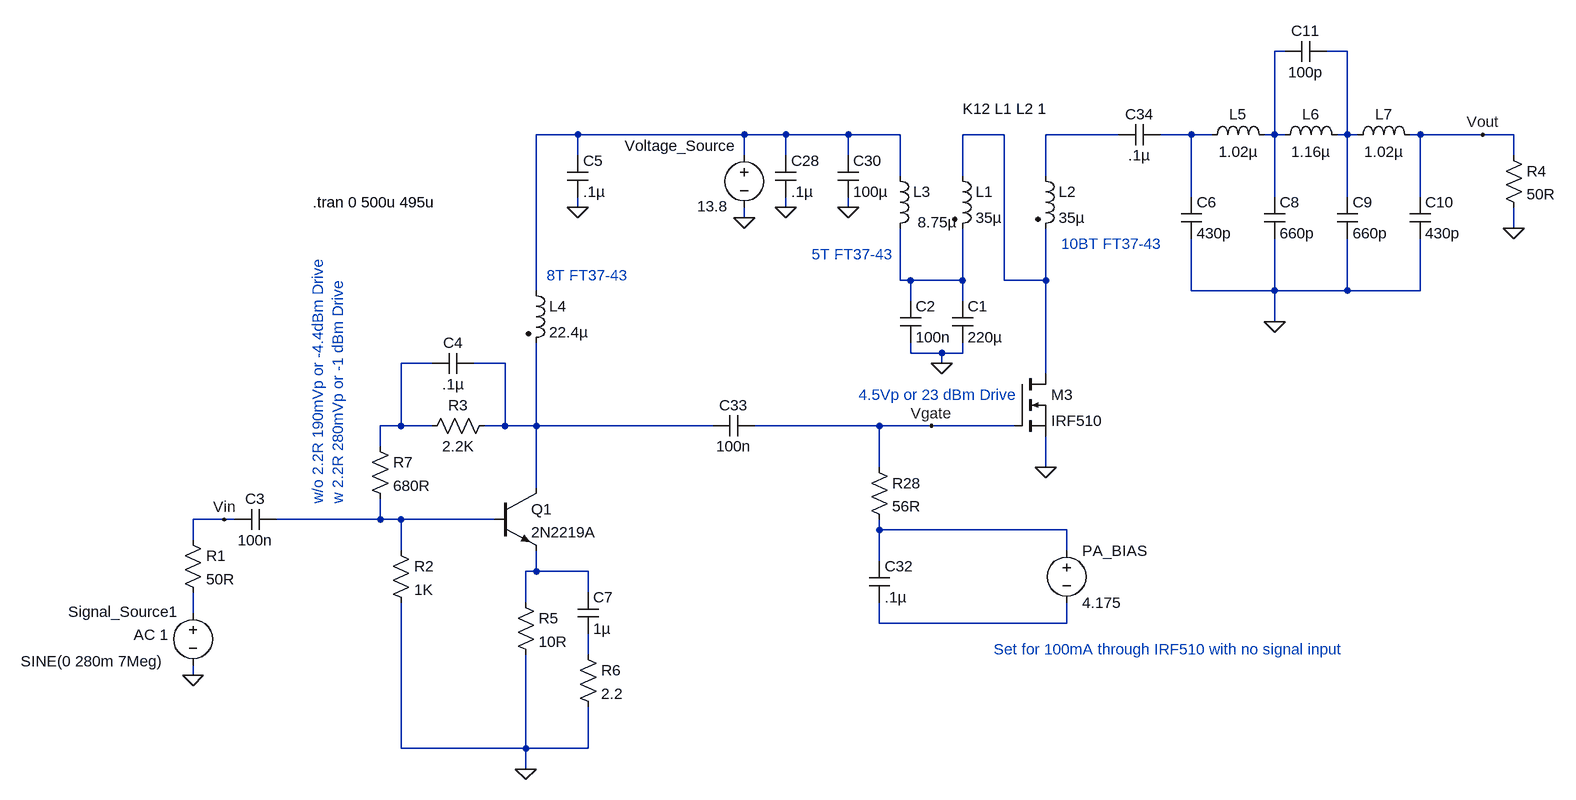
[diagram p0: schematic Power Amp Driver+IRF510 Stage.asc]
Power Amp Driver+IRF510 Stage.asc, the LTspice schematic file:
Version 4
SHEET 1 2716 3076
WIRE 1280 1264 1264 1264
WIRE 1376 1264 1344 1264
WIRE 192 1392 128 1392
WIRE 448 1392 192 1392
WIRE 512 1392 448 1392
WIRE 608 1392 512 1392
WIRE 688 1392 608 1392
WIRE 848 1392 784 1392
WIRE 1024 1392 912 1392
WIRE 1136 1392 1088 1392
WIRE 1168 1392 1136 1392
WIRE 1264 1392 1264 1264
WIRE 1264 1392 1248 1392
WIRE 1280 1392 1264 1392
WIRE 1376 1392 1376 1264
WIRE 1376 1392 1360 1392
WIRE 1392 1392 1376 1392
WIRE 1488 1392 1472 1392
WIRE 1584 1392 1488 1392
WIRE 1632 1392 1584 1392
WIRE 192 1424 192 1392
WIRE 448 1424 448 1392
WIRE 512 1424 512 1392
WIRE 608 1424 608 1392
WIRE 1632 1424 1632 1392
WIRE 688 1456 688 1392
WIRE 784 1456 784 1392
WIRE 912 1456 912 1392
WIRE 1136 1488 1136 1392
WIRE 1264 1488 1264 1392
WIRE 1376 1488 1376 1392
WIRE 1488 1488 1488 1392
WIRE 192 1504 192 1488
WIRE 512 1504 512 1488
WIRE 608 1504 608 1488
WIRE 448 1520 448 1504
WIRE 1632 1536 1632 1504
WIRE 688 1616 688 1536
WIRE 704 1616 688 1616
WIRE 784 1616 784 1536
WIRE 784 1616 704 1616
WIRE 848 1616 848 1392
WIRE 912 1616 912 1536
WIRE 912 1616 848 1616
WIRE 128 1632 128 1392
WIRE 1136 1632 1136 1552
WIRE 1264 1632 1264 1552
WIRE 1264 1632 1136 1632
WIRE 1376 1632 1376 1552
WIRE 1376 1632 1264 1632
WIRE 1488 1632 1488 1552
WIRE 1488 1632 1376 1632
WIRE 704 1648 704 1616
WIRE 784 1648 784 1616
WIRE 1264 1680 1264 1632
WIRE 704 1728 704 1712
WIRE 752 1728 704 1728
WIRE 784 1728 784 1712
WIRE 784 1728 752 1728
WIRE -32 1744 -80 1744
WIRE 80 1744 32 1744
WIRE 752 1744 752 1728
WIRE 912 1760 912 1616
WIRE -80 1840 -80 1744
WIRE -80 1840 -112 1840
WIRE -32 1840 -80 1840
WIRE 80 1840 80 1744
WIRE 80 1840 48 1840
WIRE 128 1840 128 1712
WIRE 128 1840 80 1840
WIRE 400 1840 128 1840
WIRE 656 1840 464 1840
WIRE 736 1840 656 1840
WIRE 864 1840 736 1840
WIRE -112 1872 -112 1840
WIRE 656 1904 656 1840
WIRE 912 1904 912 1856
WIRE 128 1936 128 1840
WIRE -352 1984 -400 1984
WIRE -336 1984 -352 1984
WIRE -112 1984 -112 1952
WIRE -112 1984 -272 1984
WIRE -80 1984 -112 1984
WIRE 64 1984 -80 1984
WIRE 656 2000 656 1984
WIRE 944 2000 656 2000
WIRE -400 2016 -400 1984
WIRE -80 2032 -80 1984
WIRE 944 2032 944 2000
WIRE 656 2048 656 2000
WIRE 128 2064 128 2032
WIRE 128 2064 112 2064
WIRE 208 2064 128 2064
WIRE 208 2096 208 2064
WIRE 112 2112 112 2064
WIRE -400 2128 -400 2096
WIRE 656 2144 656 2112
WIRE 944 2144 944 2112
WIRE 944 2144 656 2144
WIRE 208 2192 208 2160
WIRE -400 2224 -400 2208
WIRE -80 2336 -80 2112
WIRE 112 2336 112 2192
WIRE 112 2336 -80 2336
WIRE 208 2336 208 2272
WIRE 208 2336 112 2336
WIRE 112 2368 112 2336
FLAG 512 1504 0
FLAG 608 1504 0
FLAG 912 1904 0
FLAG 736 1840 Vgate
FLAG 448 1520 0
FLAG 752 1744 0
FLAG -400 2224 0
FLAG 192 1504 0
FLAG -352 1984 Vin
FLAG 112 2368 0
FLAG 1632 1536 0
FLAG 1584 1392 Vout
FLAG 1264 1680 0
SYMBOL nmos 864 1760 R0
SYMATTR InstName M3
SYMATTR Value IRF510
SYMBOL voltage 448 1408 R0
WINDOW 123 0 0 Left 2
WINDOW 39 0 0 Left 2
WINDOW 0 -184 1 Left 2
WINDOW 3 -72 94 Left 2
SYMATTR InstName Voltage_Source
SYMATTR Value 13.8
SYMBOL cap 496 1424 R0
SYMATTR InstName C28
SYMATTR Value .1µ
SYMBOL ind2 768 1440 R0
SYMATTR InstName L1
SYMATTR Value 35µ
SYMATTR Type ind
SYMBOL ind2 896 1440 R0
SYMATTR InstName L2
SYMATTR Value 35µ
SYMATTR Type ind
SYMBOL ind 672 1440 R0
WINDOW 3 43 87 Left 2
SYMATTR Value 8.75µ
SYMATTR InstName L3
SYMBOL cap 592 1424 R0
SYMATTR InstName C30
SYMATTR Value 100µ
SYMBOL res 640 1888 R0
SYMATTR InstName R28
SYMATTR Value 56R
SYMBOL cap 640 2048 R0
SYMATTR InstName C32
SYMATTR Value .1µ
SYMBOL voltage 944 2016 R0
WINDOW 123 0 0 Left 2
WINDOW 39 0 0 Left 2
SYMATTR InstName PA_BIAS
SYMATTR Value 4.175
SYMBOL cap 464 1824 R90
WINDOW 0 0 32 VBottom 2
WINDOW 3 32 32 VTop 2
SYMATTR InstName C33
SYMATTR Value 100n
SYMBOL cap 1088 1376 R90
WINDOW 0 0 32 VBottom 2
WINDOW 3 32 32 VTop 2
SYMATTR InstName C34
SYMATTR Value .1µ
SYMBOL cap 768 1648 R0
SYMATTR InstName C1
SYMATTR Value 220µ
SYMBOL cap 688 1648 R0
SYMATTR InstName C2
SYMATTR Value 100n
SYMBOL voltage -400 2112 R0
WINDOW 3 -265 90 Left 2
WINDOW 123 -91 49 Left 2
WINDOW 0 -192 14 Left 2
WINDOW 39 0 0 Left 2
SYMATTR Value SINE(0 280m 7Meg)
SYMATTR Value2 AC 1
SYMATTR InstName Signal_Source1
SYMBOL res -416 2000 R0
SYMATTR InstName R1
SYMATTR Value 50R
SYMBOL npn 64 1936 R0
SYMATTR InstName Q1
SYMATTR Value 2N2219A
SYMBOL cap -272 1968 R90
WINDOW 0 0 32 VBottom 2
WINDOW 3 32 32 VTop 2
SYMATTR InstName C3
SYMATTR Value 100n
SYMBOL res -96 2016 R0
SYMATTR InstName R2
SYMATTR Value 1K
SYMBOL res 64 1824 R90
WINDOW 0 0 56 VBottom 2
WINDOW 3 32 56 VTop 2
SYMATTR InstName R3
SYMATTR Value 2.2K
SYMBOL cap 32 1728 R90
WINDOW 0 0 32 VBottom 2
WINDOW 3 32 32 VTop 2
SYMATTR InstName C4
SYMATTR Value .1µ
SYMBOL ind2 112 1616 R0
SYMATTR InstName L4
SYMATTR Value 22.4µ
SYMATTR Type ind
SYMBOL res 96 2096 R0
SYMATTR InstName R5
SYMATTR Value 10R
SYMBOL cap 176 1424 R0
SYMATTR InstName C5
SYMATTR Value .1µ
SYMBOL res -128 1856 R0
SYMATTR InstName R7
SYMATTR Value 680R
SYMBOL cap 192 2096 R0
SYMATTR InstName C7
SYMATTR Value 1µ
SYMBOL res 1616 1408 R0
SYMATTR InstName R4
SYMATTR Value 50R
SYMBOL ind 1152 1408 R270
WINDOW 0 32 56 VTop 2
WINDOW 3 5 56 VBottom 2
SYMATTR InstName L5
SYMATTR Value 1.02µ
SYMBOL ind 1264 1408 R270
WINDOW 0 32 56 VTop 2
WINDOW 3 5 56 VBottom 2
SYMATTR InstName L6
SYMATTR Value 1.16µ
SYMBOL ind 1376 1408 R270
WINDOW 0 32 56 VTop 2
WINDOW 3 5 56 VBottom 2
SYMATTR InstName L7
SYMATTR Value 1.02µ
SYMBOL cap 1120 1488 R0
SYMATTR InstName C6
SYMATTR Value 430p
SYMBOL cap 1248 1488 R0
SYMATTR InstName C8
SYMATTR Value 660p
SYMBOL cap 1360 1488 R0
SYMATTR InstName C9
SYMATTR Value 660p
SYMBOL cap 1472 1488 R0
SYMATTR InstName C10
SYMATTR Value 430p
SYMBOL cap 1344 1248 R90
WINDOW 0 0 32 VBottom 2
WINDOW 3 32 32 VTop 2
SYMATTR InstName C11
SYMATTR Value 100p
SYMBOL res 192 2176 R0
SYMATTR InstName R6
SYMATTR Value 2.2
TEXT 784 1352 Left 2 !K12 L1 L2 1
TEXT 832 2184 Left 2 ;Set for 100mA through IRF510 with no signal input
TEXT 624 1792 Left 2 ;4.5Vp or 23 dBm Drive
TEXT -216 1496 Left 2 !.tran 0 500u 495u
TEXT -208 1960 VLeft 2 ;w/o 2.2R 190mVp or -4.4dBm Drive\nw 2.2R 280mVp or -1 dBm Drive
TEXT 144 1608 Left 2 ;8T FT37-43
TEXT 552 1576 Left 2 ;5T FT37-43
TEXT 936 1560 Left 2 ;10BT FT37-43

The netlist it stands for:
* Power Amp Driver+IRF510 Stage.asc
M3 N004 Vgate 0 0 IRF510
Voltage_Source N003 0 13.8
C28 N003 0 .1µ
L1 N004 N007 35µ
L2 N005 N004 35µ
L3 N003 N007 8.75µ
C30 N003 0 100µ
R28 Vgate N011 56R
C32 N011 N014 .1µ
V§PA_BIAS N011 N014 4.175
C33 Vgate N009 100n
C34 N006 N005 .1µ
C1 N007 0 220µ
C2 N007 0 100n
V§Signal_Source1 N013 0 SINE(0 280m 7Meg) AC 1
R1 Vin N013 50R
Q1 N009 N010 N012 0 2N2219A
C3 N010 Vin 100n
R2 N010 0 1K
R3 N009 N008 2.2K
C4 N009 N008 .1µ
L4 N003 N009 22.4µ
R5 N012 0 10R
C5 N003 0 .1µ
R7 N008 N010 680R
C7 N012 N015 1µ
R4 Vout 0 50R
L5 N006 N001 1.02µ
L6 N001 N002 1.16µ
L7 N002 Vout 1.02µ
C6 N006 0 430p
C8 N001 0 660p
C9 N002 0 660p
C10 Vout 0 430p
C11 N002 N001 100p
R6 N015 0 2.2
.model NPN NPN
.model PNP PNP
.lib standard.bjt
.model NMOS NMOS
.model PMOS PMOS
.lib standard.mos
K12 L1 L2 1
* Set for 100mA through IRF510 with no signal input
* 4.5Vp or 23 dBm Drive
.tran 0 500u 495u
* w/o 2.2R 190mVp or -4.4dBm Drive
* w 2.2R 280mVp or -1 dBm Drive
* 8T FT37-43
* 5T FT37-43
* 10BT FT37-43
.backanno
.end